# Altium project PCB_Project_XL6009.PrjPcb
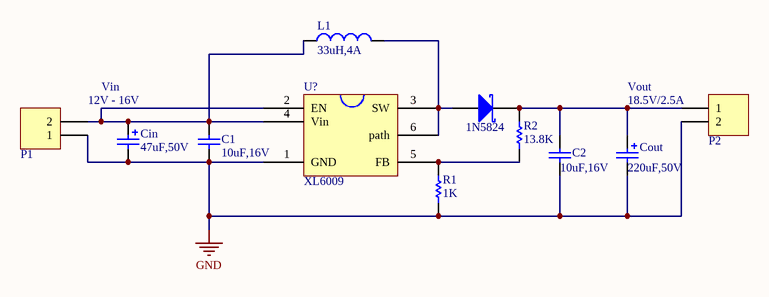
[diagram p0: schematic_XL6009.SchDoc]
1 sheet, 11 parts. Net scope: global (net labels, ports and power ports of the same name join across sheets).
Board file: PCB_XL6009 DC-DC converter.PcbDoc

## Sheet schematic_XL6009.SchDoc
size A

### Parts
1N5824  D Schottky  [SS34]  (value not drawn)
C1  value 10uF,16V  [CAP-SM-0805]  (hidden comment: Cap Non-Pol SMD)
C2  value 10uF,16V  [CAP-SM-0805]  (hidden comment: Cap Non-Pol SMD)
Cin  value 47uF,50V  [CAP ALU SIZE B]  (hidden comment: Cap Pol SMD)
Cout  value 220uF,50V  [CAP ALU SIZE B]  (hidden comment: Cap Pol SMD)
L1  value 33uH,4A  [INDUCTOR 12.5x12.5]  (hidden comment: Inductor)
P1  Domino 2  [DOMINO 2- 5mm]  (value not drawn)
P2  Domino 2  [DOMINO 2- 5mm]  (value not drawn)
R1  value 1K  [RES-SM-0603]  (hidden comment: RESISTOR SMD)
R2  value 13.8K  [RES-SM-0603]  (hidden comment: RESISTOR SMD)
U?  XL6009  [PCBComponent_1]

### Nets
GND: C1.1 C2.1 Cin.2 Cout.2 P1.1 P2.2 R1.1 U?.1(GND)
Net1N5824_1: 1N5824.1(A) L1.2 U?.3(SW) U?.6(path)
Net1N5824_2: 1N5824.2(K) C2.2 Cout.1 P2.1 R2.1
NetC1_2: C1.2 Cin.1 L1.1 P1.2 U?.2(EN) U?.4(Vin)
NetR1_2: R1.2 R2.2 U?.5(FB)

### Notes on the sheet
- Vin
- Vout
- 12V - 16V
- (near P2) 18.5V/2.5A

### Library data of the parts
1N5824 = D Schottky: Schottky Diode; Published: 8-Jun-2000; LatestRevisionDate: 17-Jul-2002; LatestRevisionNote: Re-released for DXP Platform.; PackageReference: SMB; Publisher: Altium Limited; PackageDescription: DO-214-AA/SMB; 2 C-Bend Leads; Body 5.3 x 3.6 mm, inc. leads (LxW); Code_JEDEC: DO-214-AA
C1 C2 = Cap Non-Pol SMD: Capacitor
Cin Cout = Cap Pol SMD: Polarized Capacitor (Radial)
P1 P2 = Domino 2: Domino, 2-Pin; LatestRevisionDate: 17-Jul-2002; LatestRevisionNote: Re-released for DXP Platform.; Publisher: Altium Limited
R1 R2 = RESISTOR SMD: Resistor